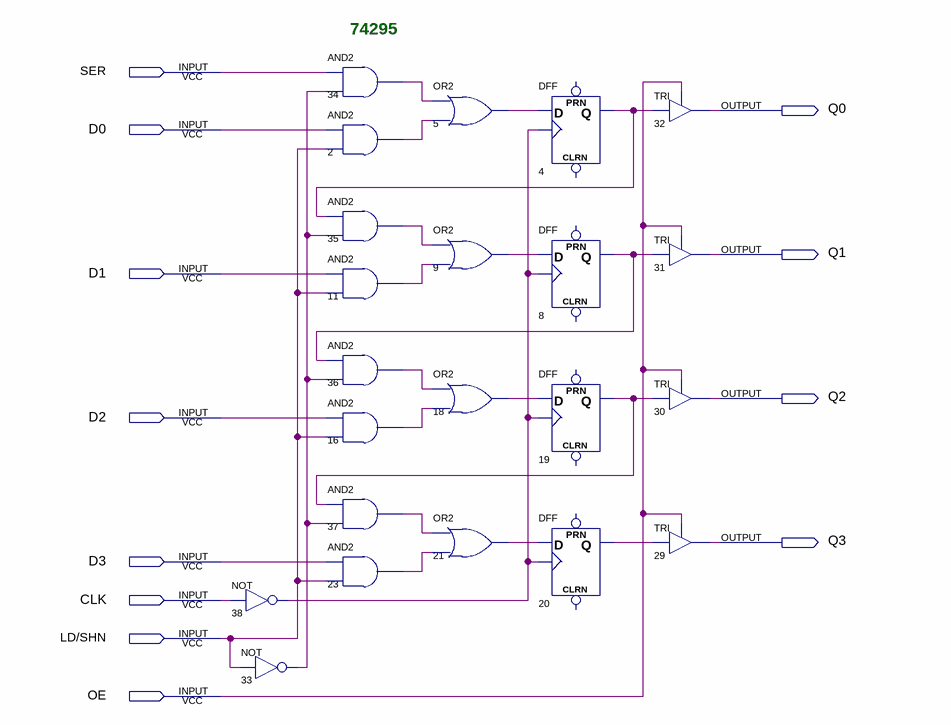
[diagram p0: schematic sheet]
// Quartus schematic 74295.bdf as structural Verilog: 22 symbols, 12 pins
module \74295  (
  input  SER,
  input  D0,
  input  D1,
  input  D2,
  input  D3,
  input  CLK,
  input  \LD/SHN ,
  input  OE,
  output Q0,
  output Q1,
  output Q2,
  output Q3
);

  wire n2_out, n4_q, n5_out, n8_q, n9_out, n11_out, n16_out, n18_out, n19_q, n20_q, n21_out, n23_out,
       n33_out, n34_out, n35_out, n36_out, n37_out, n38_out;

  not u_38 (n38_out, CLK);
  not u_33 (n33_out, \LD/SHN );
  and u_34 (n34_out, SER, n33_out);
  and u_2 (n2_out, D0, \LD/SHN );
  and u_35 (n35_out, n4_q, n33_out);
  and u_11 (n11_out, D1, \LD/SHN );
  and u_36 (n36_out, n8_q, n33_out);
  and u_16 (n16_out, D2, \LD/SHN );
  and u_37 (n37_out, n19_q, n33_out);
  and u_23 (n23_out, D3, \LD/SHN );
  or u_5 (n5_out, n34_out, n2_out);
  or u_9 (n9_out, n35_out, n11_out);
  or u_18 (n18_out, n36_out, n16_out);
  or u_21 (n21_out, n37_out, n23_out);
  DFF u_4 (.CLK(n38_out), .D(n5_out), .Q(n4_q));  // open: CLRN, PRN
  DFF u_8 (.CLK(n38_out), .D(n9_out), .Q(n8_q));  // open: CLRN, PRN
  DFF u_19 (.CLK(n38_out), .D(n18_out), .Q(n19_q));  // open: CLRN, PRN
  DFF u_20 (.CLK(n38_out), .D(n21_out), .Q(n20_q));  // open: CLRN, PRN
  TRI u_32 (.IN(n4_q), .OE(OE), .OUT(Q0));
  TRI u_31 (.IN(n8_q), .OE(OE), .OUT(Q1));
  TRI u_30 (.IN(n19_q), .OE(OE), .OUT(Q2));
  TRI u_29 (.IN(n20_q), .OE(OE), .OUT(Q3));

  // Notes on the sheet:
  //   74295
endmodule
